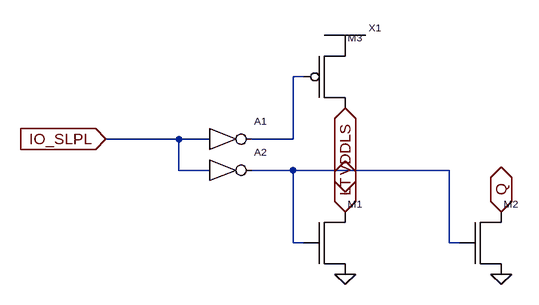
[diagram p0: schematic IO_PULLDOWN.asc]
IO_PULLDOWN.asc, the LTspice schematic file:
Version 4
SHEET 1 880 680
WIRE 176 -16 160 -16
WIRE -16 80 -128 80
WIRE 32 80 -16 80
WIRE 160 80 160 -16
WIRE 160 80 96 80
WIRE -16 128 -16 80
WIRE 32 128 -16 128
WIRE 160 128 96 128
WIRE 400 128 160 128
WIRE 160 240 160 128
WIRE 176 240 160 240
WIRE 400 240 400 128
WIRE 416 240 400 240
FLAG -128 80 IO_SLPL
IOPIN -128 80 In
FLAG 240 288 0
FLAG 480 288 0
FLAG 240 192 LT
IOPIN 240 192 BiDir
FLAG 480 192 Q
IOPIN 480 192 BiDir
FLAG 240 32 VDDLS
IOPIN 240 32 BiDir
SYMBOL INV 48 80 R0
SYMATTR InstName A1
SYMBOL INV 48 128 R0
SYMATTR InstName A2
SYMBOL NMOS 224 240 R0
SYMATTR InstName M1
SYMBOL NMOS 464 240 R0
SYMATTR InstName M2
SYMBOL PMOS 224 -16 R0
SYMATTR InstName M3
SYMBOL VDD 240 -80 R0
SYMATTR InstName X1

The netlist it stands for:
* IO_PULLDOWN.asc
A1 IO_SLPL 0 0 0 0 N001 0 0 BUF
A2 IO_SLPL 0 0 0 0 N002 0 0 BUF
M1 LT N002 0 0
M2 Q N002 0 0
M3 P001 N001 VDDLS VDDLS
XX1 P001 VDD
.model NMOS NMOS
.model PMOS PMOS
.lib standard.mos
.backanno
.end